# Altium project chiller_controller.PrjPcb
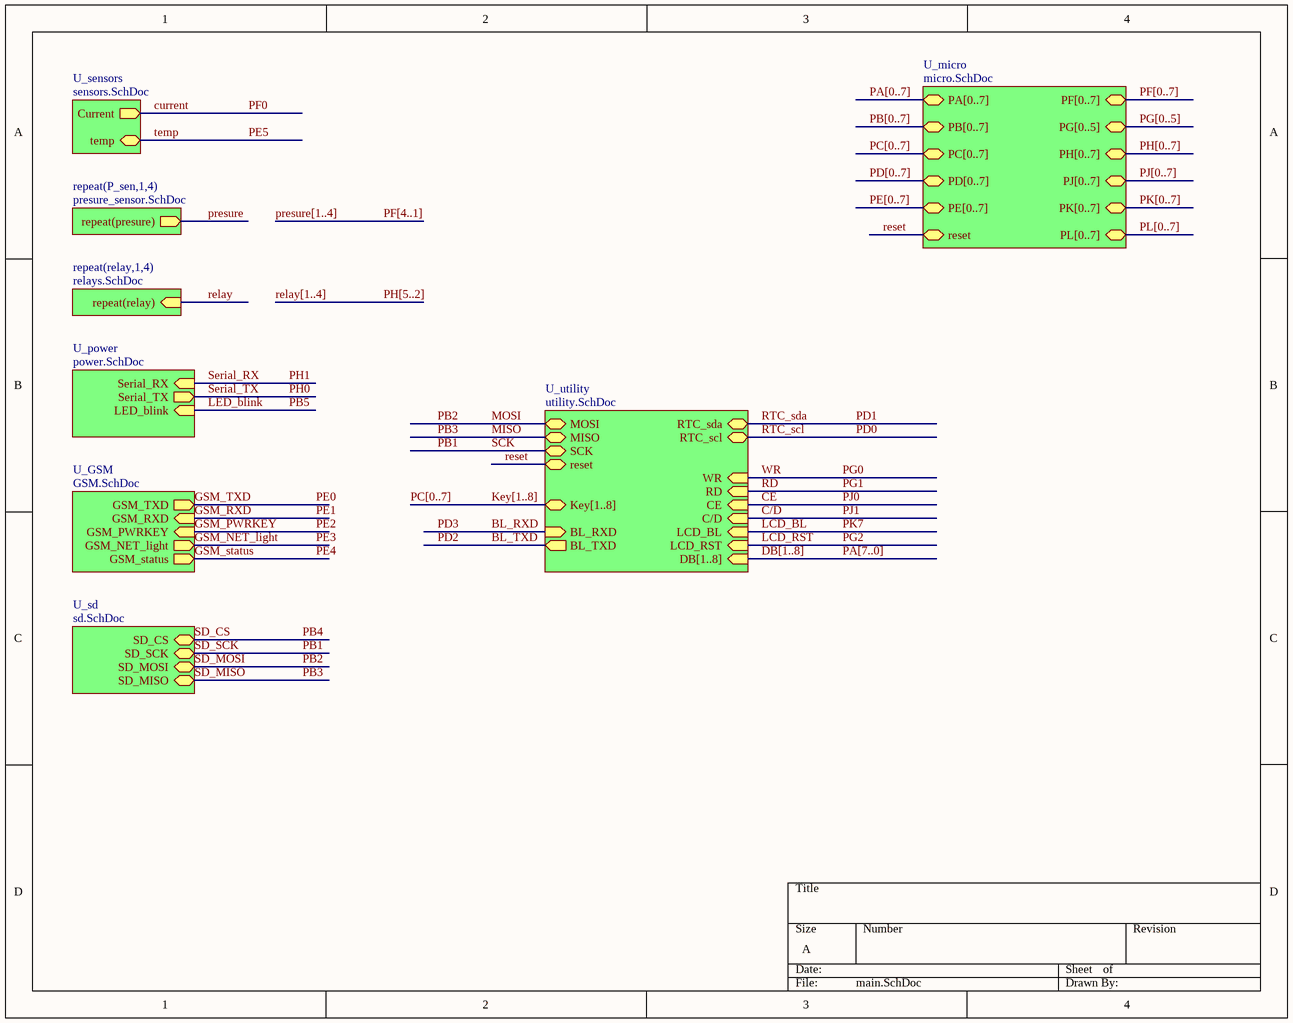
[diagram p0: main.SchDoc]
10 sheets, 200 parts. Net scope: hierarchical (ports join the sheet entries above them; power ports are global).
Board file: controller.PcbDoc
Sheets:
  main.SchDoc
    U_micro = micro.SchDoc
    U_utility = utility.SchDoc
    U_sensors = sensors.SchDoc
      sen1 = temparature sensor.SchDoc
      sen2 = temparature sensor.SchDoc
      sen3 = temparature sensor.SchDoc
      sen4 = temparature sensor.SchDoc
      sen5 = temparature sensor.SchDoc
      sen6 = temparature sensor.SchDoc
      sen7 = temparature sensor.SchDoc
      sen8 = temparature sensor.SchDoc
    P_sen1 = presure_sensor.SchDoc
    P_sen2 = presure_sensor.SchDoc
    P_sen3 = presure_sensor.SchDoc
    P_sen4 = presure_sensor.SchDoc
    relay1 = relays.SchDoc
    relay2 = relays.SchDoc
    relay3 = relays.SchDoc
    relay4 = relays.SchDoc
    U_power = power.SchDoc
    U_GSM = GSM.SchDoc
    U_sd = sd.SchDoc

## Sheet main.SchDoc
size A

### Sub-sheets
repeat(P_sen,1,4) = presure_sensor.SchDoc: repeat(presure) (out)
repeat(relay,1,4) = relays.SchDoc: repeat(relay) (in)
U_GSM = GSM.SchDoc: GSM_PWRKEY (in), GSM_RXD (in), GSM_TXD (out), GSM_NET_light (out), GSM_status (out)
U_micro = micro.SchDoc: PE[0..7] (bidir), PH[0..7] (bidir), PB[0..7] (bidir), PL[0..7] (bidir), PD[0..7] (bidir), PG[0..5] (bidir), PC[0..7] (bidir), PJ[0..7] (bidir), PA[0..7] (bidir), PK[0..7] (bidir), PF[0..7] (bidir), reset (bidir)
U_power = power.SchDoc: Serial_RX (in), Serial_TX (out), LED_blink (in)
U_sd = sd.SchDoc: SD_CS (bidir), SD_SCK (bidir), SD_MOSI (bidir), SD_MISO (bidir)
U_sensors = sensors.SchDoc: temp (bidir), Current (out)
U_utility = utility.SchDoc: MOSI (bidir), MISO (bidir), SCK (bidir), reset (bidir), RTC_sda (bidir), RTC_scl (bidir), WR (in), RD (in), CE (in), C/D (in), LCD_RST (in), DB[1..8] (in), Key[1..8] (bidir), BL_RXD (in), BL_TXD (out), LCD_BL (in)

### Nets
MISO: sheet U_utility/MISO, sheet U_sd/SD_MISO  [also labelled PB3, SD_MISO]
MOSI: sheet U_utility/MOSI, sheet U_sd/SD_MOSI  [also labelled PB2, SD_MOSI]
PB1: sheet U_utility/SCK, sheet U_sd/SD_SCK  [also labelled SCK, SD_SCK]
presure: sheet repeat(P_sen,1,4)/repeat(presure)
relay: sheet repeat(relay,1,4)/repeat(relay)
reset: sheet U_micro/reset, sheet U_utility/reset

### Buses and harness runs
bus DB[1..8] = PA[7..0] = sheet U_utility/DB[1..8]
bus Key[1..8] = PC[0..7] = sheet U_utility/Key[1..8]
bus PA[0..7] = sheet U_micro/PA[0..7]
bus PB[0..7] = sheet U_micro/PB[0..7]
bus PC[0..7] = sheet U_micro/PC[0..7]
bus PD[0..7] = sheet U_micro/PD[0..7]
bus PE[0..7] = sheet U_micro/PE[0..7]
bus PF[0..7] = sheet U_micro/PF[0..7]
bus PF[4..1] = presure[1..4]
bus PG[0..5] = sheet U_micro/PG[0..5]
bus PH[0..7] = sheet U_micro/PH[0..7]
bus PH[5..2] = relay[1..4]
bus PJ[0..7] = sheet U_micro/PJ[0..7]
bus PK[0..7] = sheet U_micro/PK[0..7]
bus PL[0..7] = sheet U_micro/PL[0..7]

## Sheet micro.SchDoc
size A
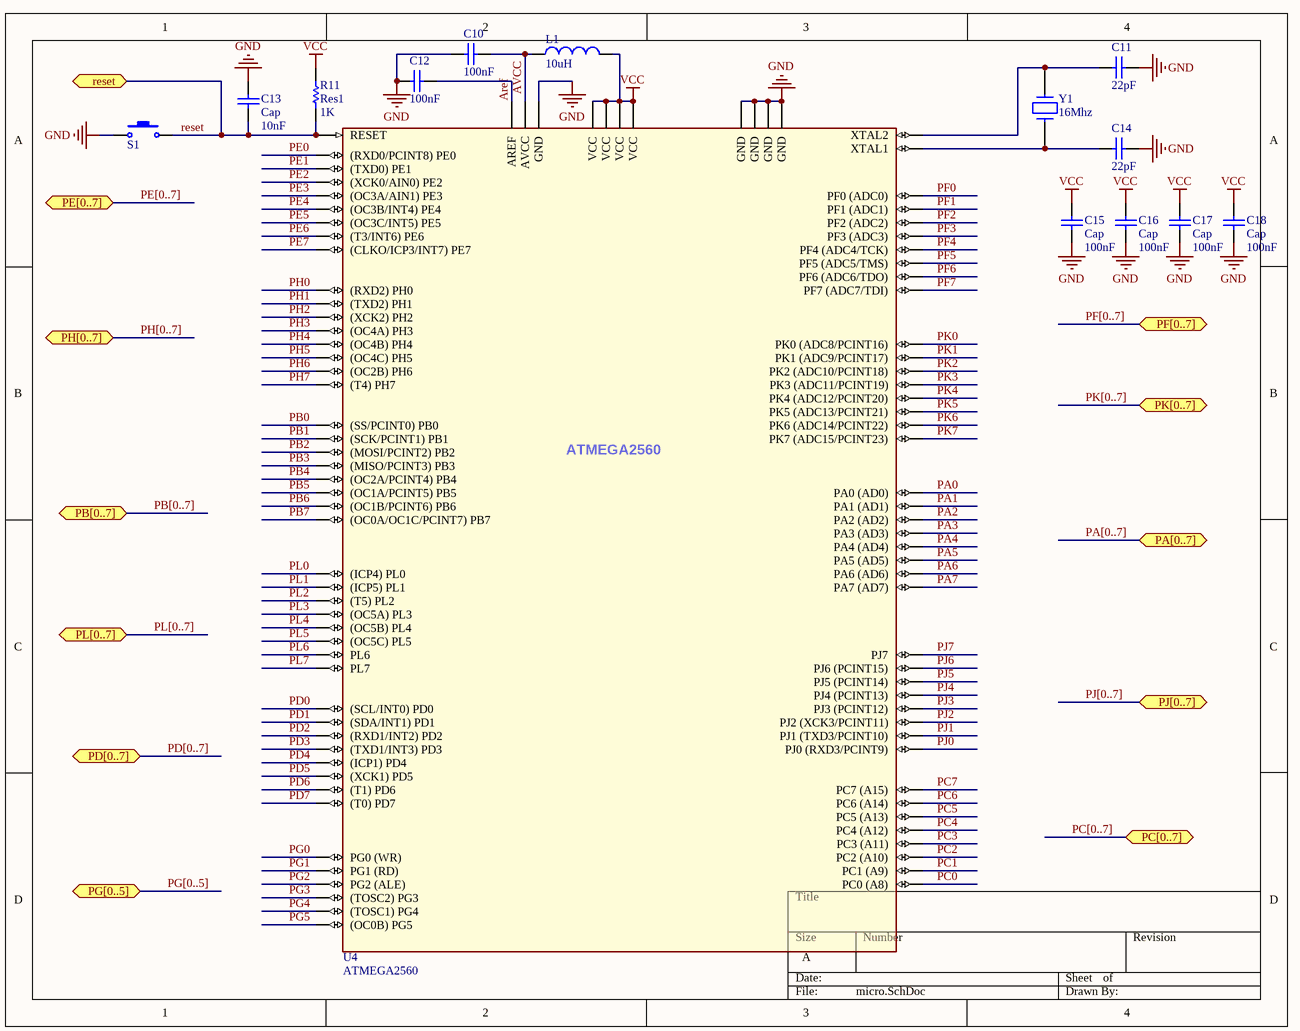
[diagram p1: micro.SchDoc]

### Parts
C10  value 100nF  [CAP 1206 (3216X15L)]  (hidden comment: Cap)
C11  value 22pF  [CAP 1206 (3216X15L)]  (hidden comment: Cap)
C12  value 100nF  [CAP 1206 (3216X15L)]  (hidden comment: Cap)
C13  Cap  value 10nF  [CAP 1206 (3216X15L)]
C14  value 22pF  [CAP 1206 (3216X15L)]  (hidden comment: Cap)
C15  Cap  value 100nF  [CAP 1206 (3216X15L)]
C16  Cap  value 100nF  [CAP 1206 (3216X15L)]
C17  Cap  value 100nF  [CAP 1206 (3216X15L)]
C18  Cap  value 100nF  [CAP 1206 (3216X15L)]
L1  value 10uH  [IND1206]  (hidden comment: Inductor)
R11  Res1  value 1K  [RES 1206 (3216X08L)]
S1  Switch PB  [Switch - Push to On]  (value not drawn)
U4  ATMEGA2560  [MY_ATMEGA2560]
Y1  16Mhz  [My_Crystal]

### Ports
PA[0..7] (bidir), PB[0..7] (bidir), PC[0..7] (bidir), PD[0..7] (bidir), PE[0..7] (bidir), PF[0..7] (bidir), PG[0..5] (bidir), PH[0..7] (bidir), PJ[0..7] (bidir), PK[0..7] (bidir), PL[0..7] (bidir), reset (bidir)

### Nets
GND: C10.1 C11.2 C12.1 C13.2 C14.2 C15.1 C16.1 C17.1 C18.1 S1.1 U4.11(GND) U4.32(GND) U4.62(GND) U4.81(GND) U4.99(GND)
VCC: C15.2 C16.2 C17.2 C18.2 L1.2 R11.2 U4.10(VCC) U4.31(VCC) U4.61(VCC) U4.80(VCC)
Aref: C12.2 U4.98(AREF)
AVCC: C10.2 L1.1 U4.100(AVCC)
PA0: U4.78(PA0_(AD0))  [project net DB8]
PA1: U4.77(PA1_(AD1))  [project net DB7]
PA2: U4.76(PA2_(AD2))  [project net DB6]
PA3: U4.75(PA3_(AD3))  [project net DB5]
PA4: U4.74(PA4_(AD4))  [project net DB4]
PA5: U4.73(PA5_(AD5))  [project net DB3]
PA6: U4.72(PA6_(AD6))  [project net DB2]
PA7: U4.71(PA7_(AD7))  [project net DB1]
PB0: U4.19((SS/PCINT0)_PB0)
PB1: U4.20((SCK/PCINT1)_PB1)
PB2: U4.21((MOSI/PCINT2)_PB2)  [project net MOSI]
PB3: U4.22((MISO/PCINT3)_PB3)  [project net MISO]
PB4: U4.23((OC2A/PCINT4)_PB4)
PB5: U4.24((OC1A/PCINT5)_PB5)  [project net LED_blink]
PB6: U4.25((OC1B/PCINT6)_PB6)
PB7: U4.26((OC0A/OC1C/PCINT7)_PB7)
PC0: U4.53(PC0_(A8))  [project net Key1]
PC1: U4.54(PC1_(A9))  [project net Key2]
PC2: U4.55(PC2_(A10))  [project net Key3]
PC3: U4.56(PC3_(A11))  [project net Key4]
PC4: U4.57(PC4_(A12))  [project net Key5]
PC5: U4.58(PC5_(A13))  [project net Key6]
PC6: U4.59(PC6_(A14))  [project net Key7]
PC7: U4.60(PC7_(A15))  [project net Key8]
PD0: U4.43((SCL/INT0)_PD0)
PD1: U4.44((SDA/INT1)_PD1)
PD2: U4.45((RXD1/INT2)_PD2)  [project net BL_TXD]
PD3: U4.46((TXD1/INT3)_PD3)  [project net BL_RXD]
PD4: U4.47((ICP1)_PD4)
PD5: U4.48((XCK1)_PD5)
PD6: U4.49((T1)_PD6)
PD7: U4.50((T0)_PD7)
PE0: U4.2((RXD0/PCINT8)_PE0)  [project net GSM_TXD]
PE1: U4.3((TXD0)_PE1)  [project net GSM_RXD]
PE2: U4.4((XCK0/AIN0)_PE2)  [project net GSM_PWRKEY]
PE3: U4.5((OC3A/AIN1)_PE3)  [project net GSM_NET_light]
PE4: U4.6((OC3B/INT4)_PE4)  [project net GSM_status]
PE5: U4.7((OC3C/INT5)_PE5)
PE6: U4.8((T3/INT6)_PE6)
PE7: U4.9((CLKO/ICP3/INT7)_PE7)
PF0: U4.97(PF0_(ADC0))  [project net current]
PF1: U4.96(PF1_(ADC1))
PF2: U4.95(PF2_(ADC2))
PF3: U4.94(PF3_(ADC3))
PF4: U4.93(PF4_(ADC4/TCK))
PF5: U4.92(PF5_(ADC5/TMS))
PF6: U4.91(PF6_(ADC6/TDO))
PF7: U4.90(PF7_(ADC7/TDI))
PG0: U4.51(PG0_(WR))
PG1: U4.52(PG1_(RD))
PG2: U4.70(PG2_(ALE))  [project net LCD_RST]
PG3: U4.28((TOSC2)_PG3)
PG4: U4.29((TOSC1)_PG4)
PG5: U4.1((OC0B)_PG5)
PH0: U4.12((RXD2)_PH0)
PH1: U4.13((TXD2)_PH1)
PH2: U4.14((XCK2)_PH2)
PH3: U4.15((OC4A)_PH3)
PH4: U4.16((OC4B)_PH4)
PH5: U4.17((OC4C)_PH5)
PH6: U4.18((OC2B)_PH6)
PH7: U4.27((T4)_PH7)
PJ0: U4.63(PJ0_(RXD3/PCINT9))  [project net CE]
PJ1: U4.64(PJ1_(TXD3/PCINT10))  [project net C/D]
PJ2: U4.65(PJ2_(XCK3/PCINT11))
PJ3: U4.66(PJ3_(PCINT12))
PJ4: U4.67(PJ4_(PCINT13))
PJ5: U4.68(PJ5_(PCINT14))
PJ6: U4.69(PJ6_(PCINT15))
PJ7: U4.79(PJ7)
PK0: U4.89(PK0_(ADC8/PCINT16))
PK1: U4.88(PK1_(ADC9/PCINT17))
PK2: U4.87(PK2_(ADC10/PCINT18))
PK3: U4.86(PK3_(ADC11/PCINT19))
PK4: U4.85(PK4_(ADC12/PCINT20))
PK5: U4.84(PK5_(ADC13/PCINT21))
PK6: U4.83(PK6_(ADC14/PCINT22))
PK7: U4.82(PK7_(ADC15/PCINT23))  [project net LCD_BL]
PL0: U4.35((ICP4)_PL0)
PL1: U4.36((ICP5)_PL1)
PL2: U4.37((T5)_PL2)
PL3: U4.38((OC5A)_PL3)
PL4: U4.39((OC5B)_PL4)
PL5: U4.40((OC5C)_PL5)
PL6: U4.41(PL6)
PL7: U4.42(PL7)
reset: C13.1 R11.1 S1.2 U4.30(RESET) ; port reset
NetC11_1: C11.1 U4.33(XTAL2) Y1.2
NetC14_1: C14.1 U4.34(XTAL1) Y1.1

### Buses and harness runs
bus PA[0..7] = port PA[0..7]
bus PB[0..7] = port PB[0..7]
bus PC[0..7] = port PC[0..7]
bus PD[0..7] = port PD[0..7]
bus PE[0..7] = port PE[0..7]
bus PF[0..7] = port PF[0..7]
bus PG[0..5] = port PG[0..5]
bus PH[0..7] = port PH[0..7]
bus PJ[0..7] = port PJ[0..7]
bus PK[0..7] = port PK[0..7]
bus PL[0..7] = port PL[0..7]

### Library data of the parts
C10-C18 = Cap ceramic: CAP-100Nf
L1 = Inductor: Code_IEC: 1005; Published: 8-Jun-2000; LatestRevisionDate: 29-May-2009; LatestRevisionNote: IPC-7351 Footprint Added.; PackageReference: 0402-A; Publisher: Altium Limited; PackageDescription: Chip Inductor; Code_JEITA: 0402
R11 = Res1: Resistor; Published: 8-Jun-2000; LatestRevisionDate: 17-Jul-2002; LatestRevisionNote: Re-released for DXP Platform.; PackageReference: AXIAL-0.3; Publisher: Altium Limited; PackageDescription: Axial Device, Thru-Hole; 2 Leads; 0.3 in Pin Spacing
S1 = Switch PB: Push Button Switch
U4 = ATMEGA2560: AVR 256K Bytes of In-System Programmable Flash Memory
Y1 = CRYSTAL

## Sheet utility.SchDoc
size A
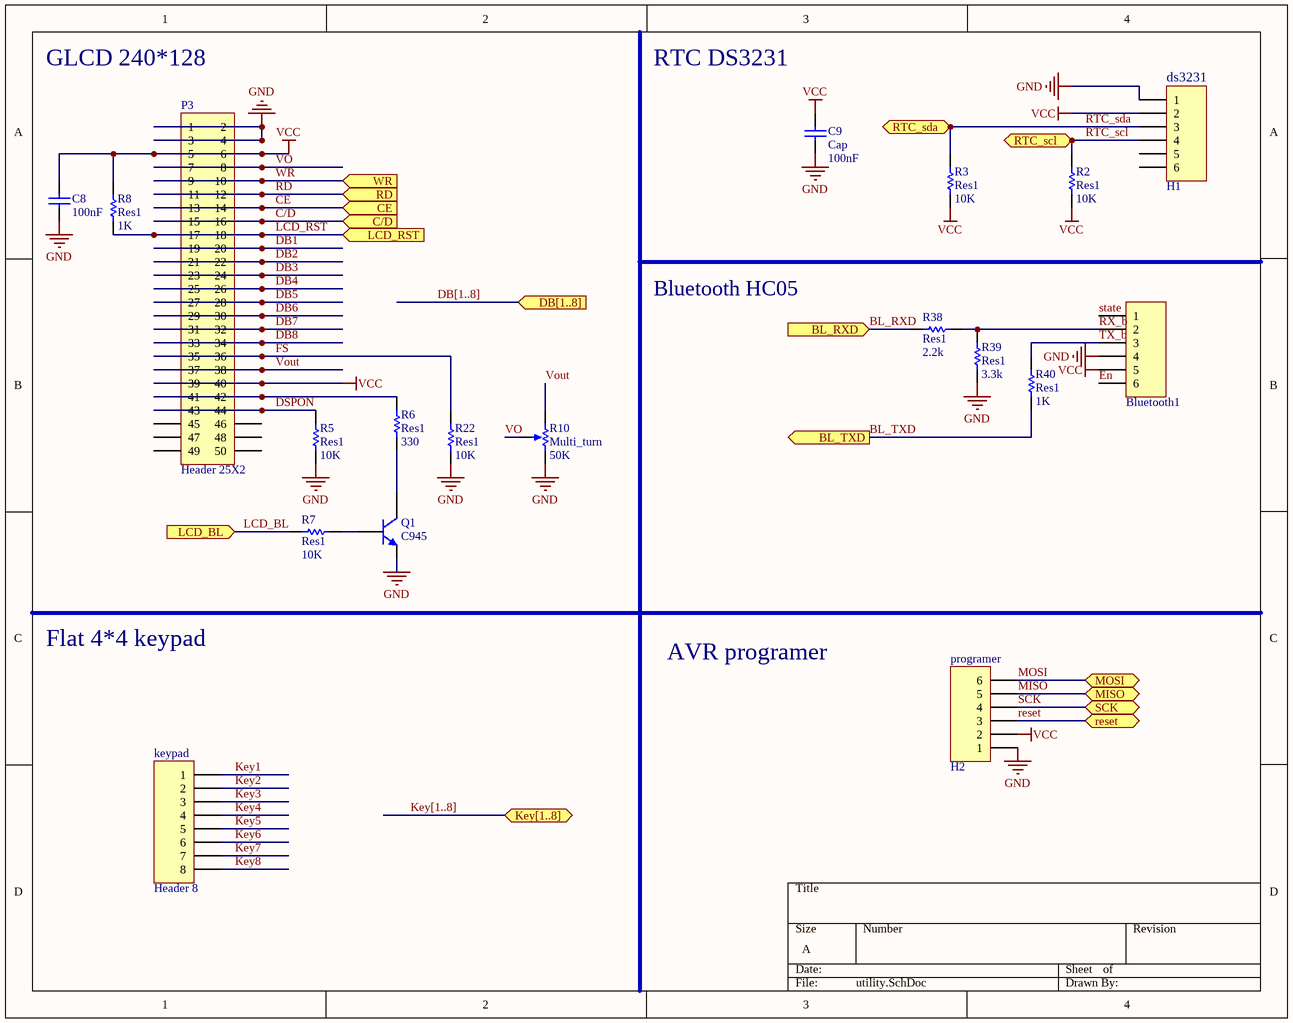
[diagram p2: utility.SchDoc]

### Parts
Bluetooth1  H-1x6  [H-1x6]  (value not drawn)
C8  value 100nF  [CAP 1206 (3216X15L)]  (hidden comment: Cap)
C9  Cap  value 100nF  [CAP 1206 (3216X15L)]
H1  H-1x6  [ds3231]  (value not drawn)
H2  programer  [HDR1X6]
keypad  Header 8  [HDR1X8]
P3  Header 25X2  [HDR2X25]
Q1  C945  [SOT23_N]
R2  Res1  value 10K  [RES 1206 (3216X08L)]
R3  Res1  value 10K  [RES 1206 (3216X08L)]
R5  Res1  value 10K  [RES 1206 (3216X08L)]
R6  Res1  value 330  [RES 1206 (3216X08L)]
R7  Res1  value 10K  [RES 1206 (3216X08L)]
R8  Res1  value 1K  [RES 1206 (3216X08L)]
R10  Multi_turn  value 50K  [Multi Turn 02]
R22  Res1  value 10K  [RES 1206 (3216X08L)]
R38  Res1  value 2.2k  [RES 1206 (3216X08L)]
R39  Res1  value 3.3k  [RES 1206 (3216X08L)]
R40  Res1  value 1K  [RES 1206 (3216X08L)]

### Ports
BL_RXD (in), BL_TXD (out), C/D (in), CE (in), DB[1..8] (in), Key[1..8] (bidir), LCD_BL (in), LCD_RST (in), MISO (bidir), MOSI (bidir), RD (in), reset (bidir), RTC_scl (bidir), RTC_sda (bidir), SCK (bidir), WR (in)

### Nets
GND: Bluetooth1.4 C8.1 C9.1 H1.1 H2.1 P3.1 P3.2 P3.3 P3.4 Q1.2(E) R5.1 R10.2(BOT) R22.1 R39.1
VCC: Bluetooth1.5 C8.2 C9.2 H1.2 H2.2 P3.5 P3.6 P3.39 P3.40 R2.1 R3.1 R8.1
BL_RXD: R38.1 ; port BL_RXD
BL_TXD: R40.2 ; port BL_TXD
C/D: P3.15 P3.16 ; port C/D
CE: P3.13 P3.14 ; port CE
DB1: P3.19 P3.20
DB2: P3.21 P3.22
DB3: P3.23 P3.24
DB4: P3.25 P3.26
DB5: P3.27 P3.28
DB6: P3.29 P3.30
DB7: P3.31 P3.32
DB8: P3.33 P3.34
DSPON: P3.43 P3.44 R5.2
En: Bluetooth1.6
FS: P3.35 P3.36 R22.2
Key1: keypad.1
Key2: keypad.2
Key3: keypad.3
Key4: keypad.4
Key5: keypad.5
Key6: keypad.6
Key7: keypad.7
Key8: keypad.8
LCD_BL: R7.2 ; port LCD_BL
LCD_RST: P3.17 P3.18 R8.2 ; port LCD_RST
MISO: H2.5 ; port MISO
MOSI: H2.6 ; port MOSI
RD: P3.11 P3.12 ; port RD  [project net PG1]
reset: H2.3 ; port reset
RTC_scl: H1.4 R2.2 ; port RTC_scl  [project net PD0]
RTC_sda: H1.3 R3.2 ; port RTC_sda  [project net PD1]
RX_b: Bluetooth1.2 R38.2 R39.2
SCK: H2.4 ; port SCK  [project net PB1]
state: Bluetooth1.1
TX_b: Bluetooth1.3 R40.1
VO: P3.7 P3.8 R10.3(TAP)
Vout: P3.37 P3.38 R10.1(TOP)
WR: P3.9 P3.10 ; port WR  [project net PG0]
NetP3_41: P3.41 P3.42 R6.2
NetQ1_1: Q1.1(B) R7.1
NetQ1_3: Q1.3(C) R6.1

Not connected (* = marked no-connect by the designer): H1 5 6; P3 45 46 47 48 49 50

### Buses and harness runs
bus DB[1..8] = port DB[1..8]
bus Key[1..8] = port Key[1..8]

### Notes on the sheet
- GLCD 240*128
- RTC DS3231
- (near H1) ds3231
- Bluetooth HC05
- Flat 4*4 keypad
- AVR programer

### Library data of the parts
C8 C9 = Cap ceramic: CAP-100Nf
H2 = H-1x6
keypad = Header 8: Header, 8-Pin; LatestRevisionDate: 17-Jul-2002; LatestRevisionNote: Re-released for DXP Platform.; Publisher: Altium Limited
P3 = Header 25X2: Header, 25-Pin, Dual row; LatestRevisionDate: 17-Jul-2002; LatestRevisionNote: Re-released for DXP Platform.; Publisher: Altium Limited
Q1 = C945: NPN Silicon Epitaxial Planar Transistor; Published: 2017-2-8; LatestRevisionDate: 2017; LatestRevisionNote: IPC-7351 Footprint Added.; DatasheetVersion: 2017; PackageVersion: 2017-2-8; PackageReference: SOT23; Publisher: Abbas Basereh; PackageDescription: 3-Pin SOT-23 Package 0.95 mm Pitch, 2.3 mm Lead Span; ComponentLink1Description: Manufacturer Link; ComponentLink1URL: http://www.taitroncomponents.com/; ComponentLink2Description: Datasheet; ComponentLink2URL: http://www.taitroncomponents.com/
R2 R3 R5-R8 R22 R38-R40 = Res1: Resistor; Published: 8-Jun-2000; LatestRevisionDate: 17-Jul-2002; LatestRevisionNote: Re-released for DXP Platform.; Publisher: Altium Limited; PackageDescription: Axial Device, Thru-Hole; 2 Leads; 0.3 in Pin Spacing
  R2 R3: PackageReference: RES 1206 (3216X08L)
  R5-R8 R22 R38-R40: PackageReference: AXIAL-0.3
R10 = Multi_turn: Potentiometer; Sim Note: Enter the Resistance value and the set point into parameter fields.; Set Position: 0.5; Published: 8-Jun-2000; LatestRevisionDate: 17-Jul-2002; LatestRevisionNote: Re-released for DXP Platform.; PackageReference: VR5; Publisher: Altium Limited

## Sheet sensors.SchDoc
size A
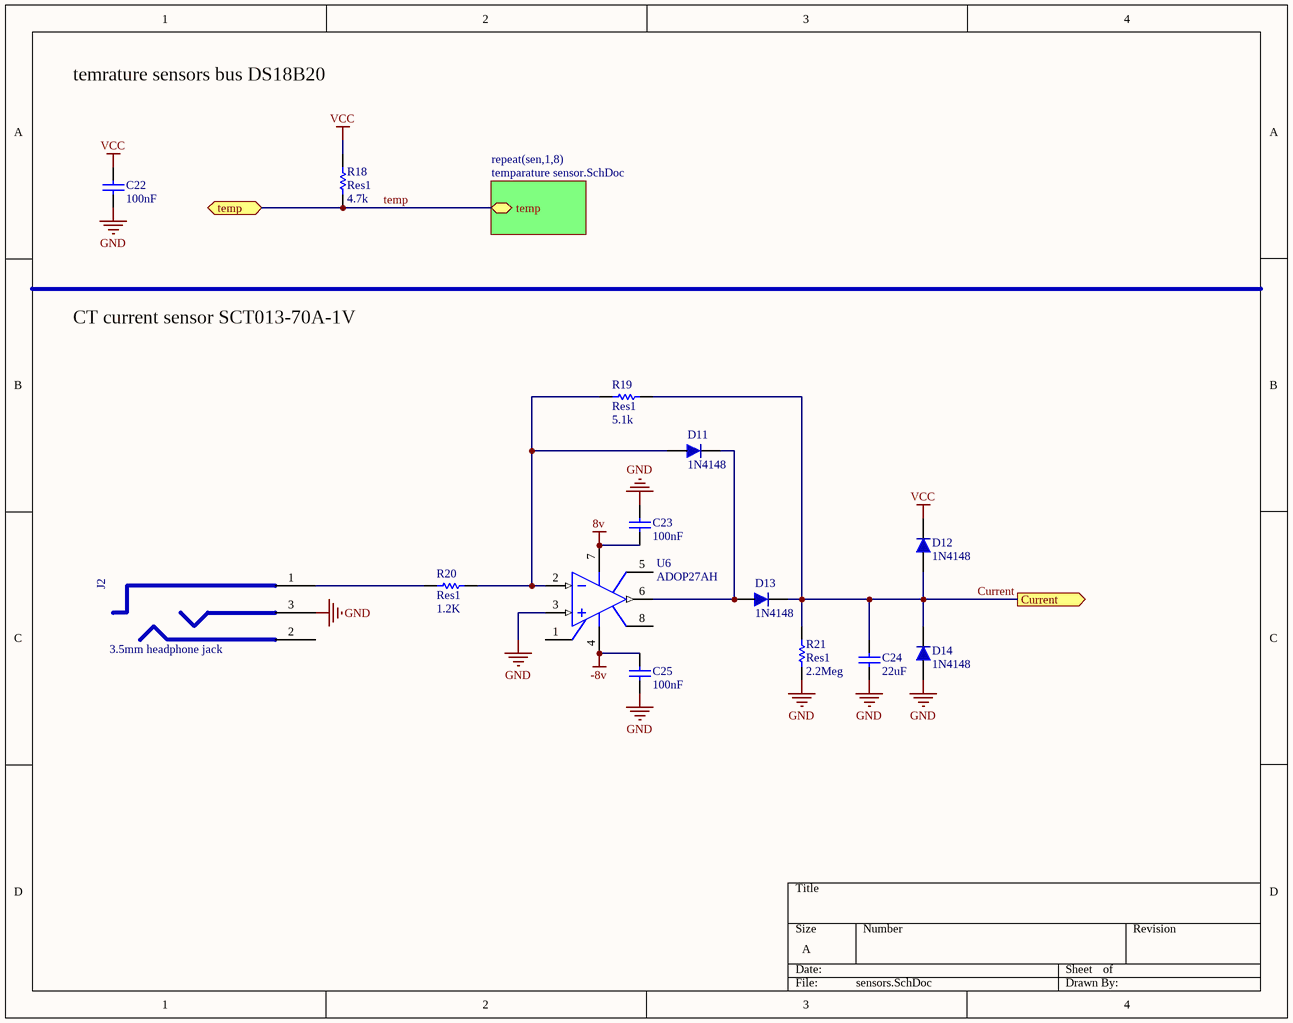
[diagram p3: sensors.SchDoc]

### Parts
C22  value 100nF  [CAP 1206 (3216X15L)]  (hidden comment: Cap)
C23  value 100nF  [CAP 1206 (3216X15L)]  (hidden comment: Cap)
C24  value 22uF  [CAP 1206 (3216X15L)]  (hidden comment: Cap)
C25  value 100nF  [CAP 1206 (3216X15L)]  (hidden comment: Cap)
D11  1N4148  [LL4148]
D12  1N4148  [LL4148]
D13  1N4148  [LL4148]
D14  1N4148  [LL4148]
J2  3.5mm headphone jack  [phone jack]
R18  Res1  value 4.7k  [RES 1206 (3216X08L)]
R19  Res1  value 5.1k  [RES 1206 (3216X08L)]
R20  Res1  value 1.2K  [RES 1206 (3216X08L)]
R21  Res1  value 2.2Meg  [RES 1206 (3216X08L)]
U6  ADOP27AH  [SOIC8-Narrow]

### Sub-sheets
repeat(sen,1,8) = temparature sensor.SchDoc: temp (bidir)

### Ports
Current (out), temp (bidir)

### Nets
8v: C23.1 U6.7(V+)
-8v: C25.2 U6.4(V-)
GND: C22.1 C23.2 C24.1 C25.1 D14.1 J2.3(Tip) R21.1 U6.3(IN+)
VCC: C22.2 D12.2 R18.2
current: C24.2 D12.1 D13.2 D14.2 R19.2 R21.2 ; port Current
temp: R18.1 ; port temp, sheet repeat(sen,1,8)/temp  [project net PE5]
NetD11_1: D11.1 R19.1 R20.2 U6.2(IN-)
NetD11_2: D11.2 D13.1 U6.6(OUT)
NetJ2_1: J2.1(Ring) R20.1

Not connected (* = marked no-connect by the designer): J2 2(Ring); U6 1(OS_NULL) 5(NC) 8(OS_NULL)

### Notes on the sheet
- temrature sensors bus DS18B20
- CT current sensor SCT013-70A-1V

### Library data of the parts
C22-C25 = Cap ceramic: CAP-100Nf
D11-D14 = 1N4148: DIODE GEN PURP 100V 200MA DO35; Published: 2017-1-12; PackageVersion: 2017-1-12; PackageReference: DO 35; Publisher: Abbas Basereh; PackageDescription: DIODE GEN PURP 100V 200MA DO35; ComponentLink1Description: Manufacturer Link; ComponentLink1URL: http://www.digikey.com/product-detail/en/fairchild-on-semiconductor/1N4148/1N4148FS-ND/458603; ComponentLink2Description: Datasheet; PART.NO: 1N4148
J2 = phone jack
R18-R21 = Res1: Resistor; Published: 8-Jun-2000; LatestRevisionDate: 17-Jul-2002; LatestRevisionNote: Re-released for DXP Platform.; PackageReference: AXIAL-0.3; Publisher: Altium Limited; PackageDescription: Axial Device, Thru-Hole; 2 Leads; 0.3 in Pin Spacing
U6 = ADOP27AH: Ultra-Low Noise, Precision Operational Amplifier; Note: Pin 5 is not connected; Pin 4 connected to case.; Published: 8-Jun-2000; LatestRevisionDate: 17-Jul-2002; LatestRevisionNote: Re-released for DXP Platform.; DatasheetVersion: 1992; PackageVersion: 1990; PackageReference: H-08A; Publisher: Altium Limited; PackageDescription: Can; 8 Leads; Pin Circle Dia. 5.08 mm; Lead Dia. 0.53 mm (max); ComponentLink1Description: Manufacturer Link; ComponentLink1URL: http://www.analog.com/

## Sheet temparature sensor.SchDoc
size A
Used 8 times, as channels U_sensors/sen1, U_sensors/sen2, U_sensors/sen3, U_sensors/sen4, U_sensors/sen5, U_sensors/sen6, U_sensors/sen7, U_sensors/sen8. Parts and nets are listed once, with the designators drawn on the sheet.
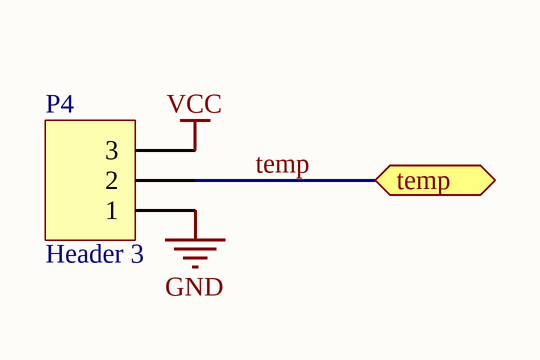
[diagram p4: temparature sensor.SchDoc]

### Parts
P4  Header 3  [3pin connector]

### Ports
temp (bidir)

### Nets
GND: P4.1
VCC: P4.3
temp: P4.2 ; port temp

### Channels
U_sensors/sen1: designators end in _sen1; ports temp=PE5
U_sensors/sen2: designators end in _sen2; ports temp=PE5
U_sensors/sen3: designators end in _sen3; ports temp=PE5
U_sensors/sen4: designators end in _sen4; ports temp=PE5
U_sensors/sen5: designators end in _sen5; ports temp=PE5
U_sensors/sen6: designators end in _sen6; ports temp=PE5
U_sensors/sen7: designators end in _sen7; ports temp=PE5
U_sensors/sen8: designators end in _sen8; ports temp=PE5

### Library data of the parts
P4 = Header 3: Header, 3-Pin; LatestRevisionDate: 17-Jul-2002; LatestRevisionNote: Re-released for DXP Platform.; Publisher: Altium Limited

## Sheet presure_sensor.SchDoc
size A
Used 4 times, as channels P_sen1, P_sen2, P_sen3, P_sen4. Parts and nets are listed once, with the designators drawn on the sheet.
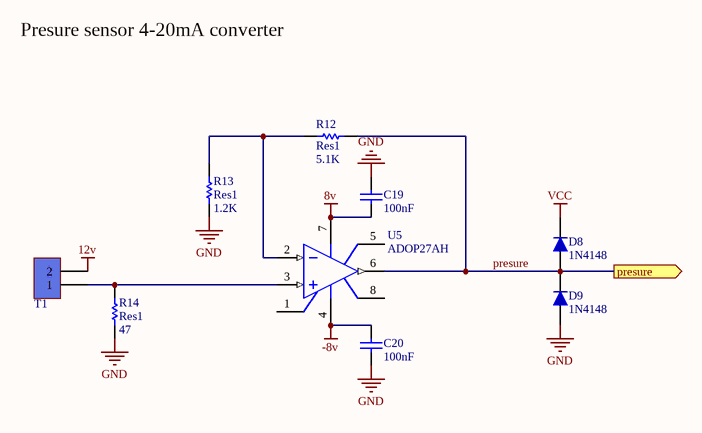
[diagram p5: presure_sensor.SchDoc]

### Parts
C19  value 100nF  [CAP 1206 (3216X15L)]  (hidden comment: Cap)
C20  value 100nF  [CAP 1206 (3216X15L)]  (hidden comment: Cap)
D8  1N4148  [LL4148]
D9  1N4148  [LL4148]
R12  Res1  value 5.1K  [RES 1206 (3216X08L)]
R13  Res1  value 1.2K  [RES 1206 (3216X08L)]
R14  Res1  value 47  [RES 1206 (3216X08L)]
T1  Terminal  [Terminal 1*2]  (value not drawn)
U5  ADOP27AH  [SOIC8-Narrow]

### Ports
presure (out)

### Nets
8v: C19.1 U5.7(V+)
12v: T1.2
-8v: C20.2 U5.4(V-)
GND: C19.2 C20.1 D9.1 R13.1 R14.1
VCC: D8.2
presure: D8.1 D9.2 R12.2 U5.6(OUT) ; port presure
NetR12_1: R12.1 R13.2 U5.2(IN-)
NetR14_2: R14.2 T1.1 U5.3(IN+)

Not connected (* = marked no-connect by the designer): U5 1(OS_NULL) 5(NC) 8(OS_NULL)

### Channels
P_sen1: designators end in _P_sen1; ports presure=PF1
P_sen2: designators end in _P_sen2; ports presure=PF2
P_sen3: designators end in _P_sen3; ports presure=PF3
P_sen4: designators end in _P_sen4; ports presure=PF4

### Notes on the sheet
- Presure sensor 4-20mA converter

### Library data of the parts
C19 C20 = Cap ceramic: CAP-100Nf
D8 D9 = 1N4148: DIODE GEN PURP 100V 200MA DO35; Published: 2017-1-12; PackageVersion: 2017-1-12; PackageReference: DO 35; Publisher: Abbas Basereh; PackageDescription: DIODE GEN PURP 100V 200MA DO35; ComponentLink1Description: Manufacturer Link; ComponentLink1URL: http://www.digikey.com/product-detail/en/fairchild-on-semiconductor/1N4148/1N4148FS-ND/458603; ComponentLink2Description: Datasheet; PART.NO: 1N4148
R12-R14 = Res1: Resistor; Published: 8-Jun-2000; LatestRevisionDate: 17-Jul-2002; LatestRevisionNote: Re-released for DXP Platform.; PackageReference: AXIAL-0.3; Publisher: Altium Limited; PackageDescription: Axial Device, Thru-Hole; 2 Leads; 0.3 in Pin Spacing
T1 = Terminal 1*2: Terminal 2 Pin 250VAC 16A; Designer: Seyed Mohsen Ghasemain; E-mail: picpars@gmail.com; ComponentLinkURL: www.picpars.com
U5 = ADOP27AH: as U6 on sheet sensors; Published: 8-Jun-2000; LatestRevisionDate: 17-Jul-2002; LatestRevisionNote: Re-released for DXP Platform.; DatasheetVersion: 1992; PackageVersion: 1990; PackageReference: H-08A; Publisher: Altium Limited; PackageDescription: Can; 8 Leads; Pin Circle Dia. 5.08 mm; Lead Dia. 0.53 mm (max); ComponentLink1Description: Manufacturer Link; ComponentLink1URL: http://www.analog.com/

## Sheet relays.SchDoc
size A
Used 4 times, as channels relay1, relay2, relay3, relay4. Parts and nets are listed once, with the designators drawn on the sheet.
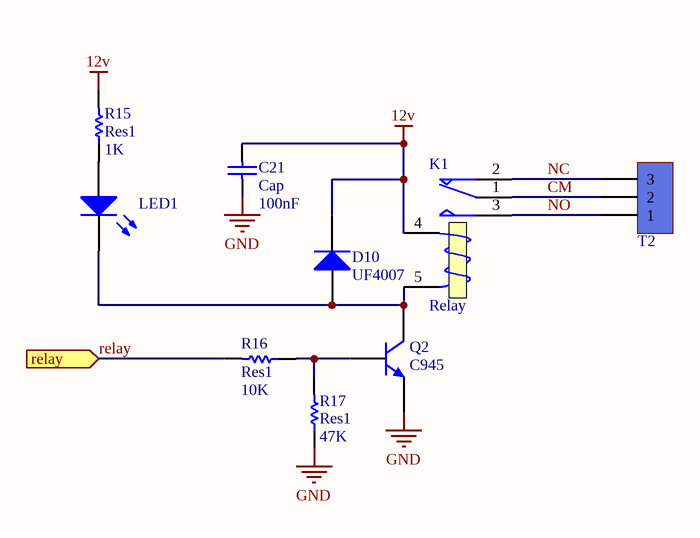
[diagram p6: relays.SchDoc]

### Parts
C21  Cap  value 100nF  [CAP 1206 (3216X15L)]
D10  UF4007  [SMA DIODE 2]
K1  Relay  [Relay 15.40x12.10x13.10]
LED1  LED0  [LED 1206]  (value not drawn)
Q2  C945  [SOT23_N]
R15  Res1  value 1K  [RES 1206 (3216X08L)]
R16  Res1  value 10K  [RES 1206 (3216X08L)]
R17  Res1  value 47K  [RES 1206 (3216X08L)]
T2  Terminal  [Terminal 1*3]  (value not drawn)

### Ports
relay (in)

### Nets
12v: C21.2 D10.2(K) K1.4(T1) R15.2
GND: C21.1 Q2.2(E) R17.1
CM: K1.1(COM) T2.2
NC: K1.2(NC) T2.3
NO: K1.3(NO) T2.1
relay: R16.2 ; port relay
NetD10_1: D10.1(A) K1.5(T2) LED1.2(K) Q2.3(C)
NetLED1_1: LED1.1(A) R15.1
NetQ2_1: Q2.1(B) R16.1 R17.2

### Channels
relay1: designators end in _relay1; ports relay=PH5
relay2: designators end in _relay2; ports relay=PH4
relay3: designators end in _relay3; ports relay=PH3
relay4: designators end in _relay4; ports relay=PH2

### Library data of the parts
C21 = Cap ceramic: CAP-100Nf
D10 = Diode: Default Diode; Published: 8-Jun-2000; LatestRevisionDate: 17-Jul-2002; LatestRevisionNote: Re-released for DXP Platform.; PackageVersion: Sep-1996; PackageReference: SMC; Publisher: Altium Limited; PackageDescription: DO-214-AB/SMC; 2 C-Bend Leads; Body 7.9 x 5.9 mm, inc. leads (LxW); Code_JEDEC: DO-214-AB
K1 = RELAY General: Relay_SPDT POWER NEEDLE; Designer: Ali Hafizi; Company: E.P.I.L; Design_Date: 2011/10/31
LED1 = LED0: Typical INFRARED GaAs LED; Published: 8-Jun-2000; LatestRevisionDate: 08-Jul-2005; LatestRevisionNote: Mech Layer 1 removed.; PackageReference: LED-0; Publisher: Altium Limited; PackageDescription: LED; 2 Leads
Q2 = C945: NPN Silicon Epitaxial Planar Transistor; Published: 2017-2-8; LatestRevisionDate: 2017; LatestRevisionNote: IPC-7351 Footprint Added.; DatasheetVersion: 2017; PackageVersion: 2017-2-8; PackageReference: SOT23; Publisher: Abbas Basereh; PackageDescription: 3-Pin SOT-23 Package 0.95 mm Pitch, 2.3 mm Lead Span; ComponentLink1Description: Manufacturer Link; ComponentLink1URL: http://www.taitroncomponents.com/; ComponentLink2Description: Datasheet; ComponentLink2URL: http://www.taitroncomponents.com/
R15-R17 = Res1: Resistor; Published: 8-Jun-2000; LatestRevisionDate: 17-Jul-2002; LatestRevisionNote: Re-released for DXP Platform.; PackageReference: AXIAL-0.3; Publisher: Altium Limited; PackageDescription: Axial Device, Thru-Hole; 2 Leads; 0.3 in Pin Spacing
T2 = Terminal 1*3: Terminal 3 Pin 250VAC 16A; Designer: Seyed Mohsen Ghasemain; E-mail: picpars@gmail.com; ComponentLinkURL: www.picpars.com

## Sheet power.SchDoc
size A
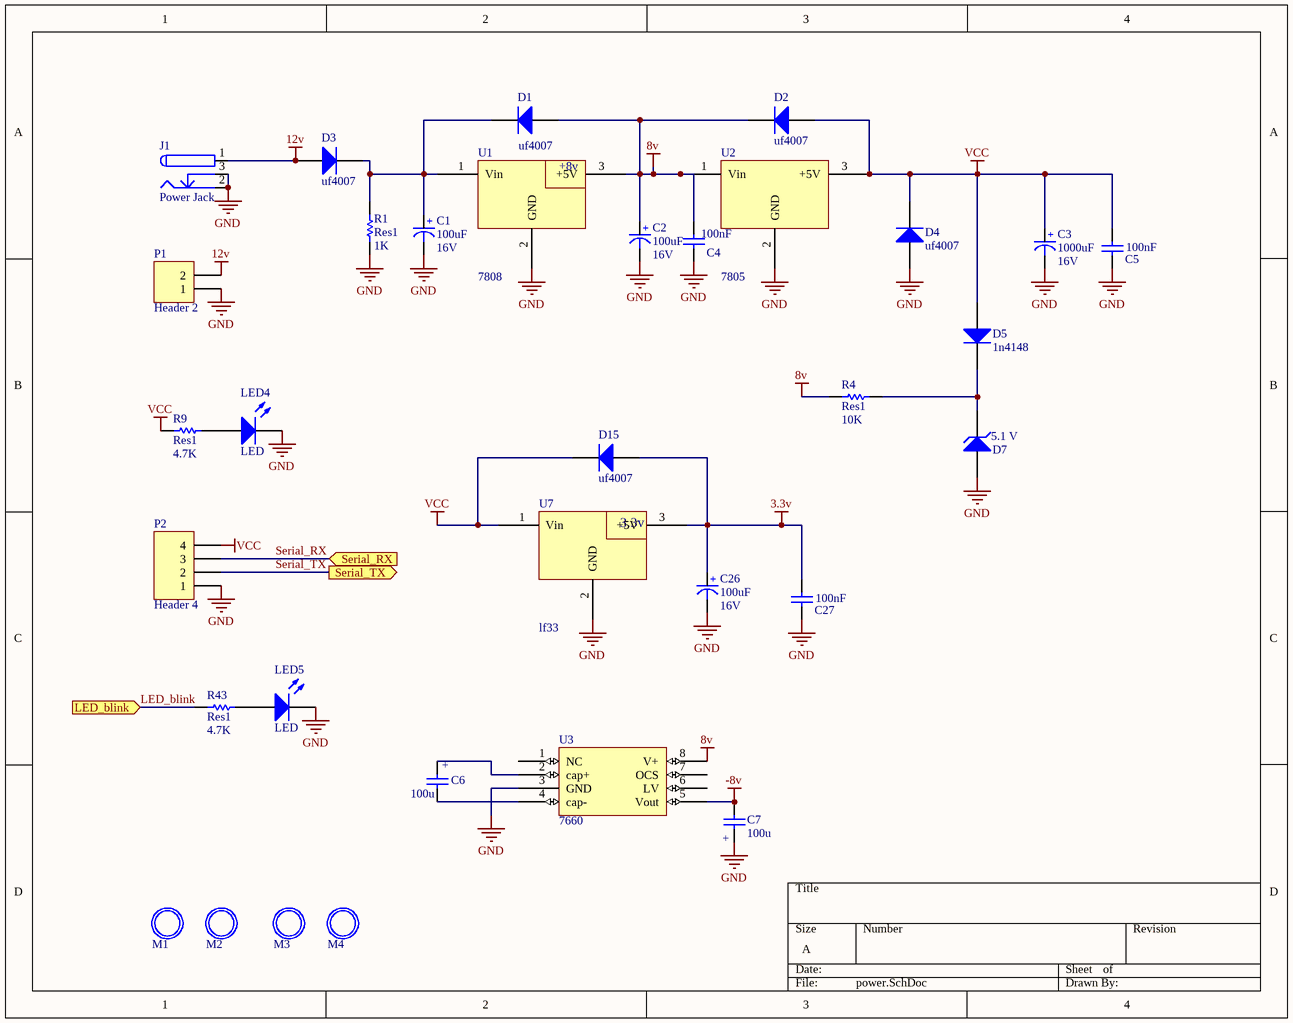
[diagram p7: power.SchDoc]

### Parts
C1  Voltage: 16V  [cap 01]  (hidden comment: 100uF)
C2  Voltage: 16V  [cap 01]  (hidden comment: 100uF)
C3  Voltage: 16V  [cap 03]  (hidden comment: 1000uF)
C4  value 100nF  [CAP 1206 (3216X15L)]  (hidden comment: Cap)
C5  value 100nF  [CAP 1206 (3216X15L)]  (hidden comment: Cap)
C6  value 100u  [cap 01]  (hidden comment: Cap)
C7  value 100u  [cap 01]  (hidden comment: Cap)
C26  Voltage: 16V  [cap 01]  (hidden comment: 100uF)
C27  value 100nF  [CAP 1206 (3216X15L)]  (hidden comment: Cap)
D1  uf4007  [SMA DIODE 2]
D2  uf4007  [SMA DIODE 2]
D3  uf4007  [SMA DIODE 2]
D4  uf4007  [SMA DIODE 2]
D5  1n4148  [LL4148]
D7  Voltage: 5.1 V  [LL4148]  (hidden comment: Diode Zener)
D15  uf4007  [SMA DIODE 2]
J1  Power Jack  [Power Jack]
LED4  LED  [LED 1206]
LED5  LED  [LED 1206]
M1  Screw  [Board Screw]  (value not drawn)
M2  Screw  [Board Screw]  (value not drawn)
M3  Screw  [Board Screw]  (value not drawn)
M4  Screw  [Board Screw]  (value not drawn)
P1  Header 2  [HDR1X2]
P2  Header 4  [HDR1X4]
R1  Res1  value 1K  [RES 1206 (3216X08L)]
R4  Res1  value 10K  [RES 1206 (3216X08L)]
R9  Res1  value 4.7K  [RES 1206 (3216X08L)]
R43  Res1  value 4.7K  [RES 1206 (3216X08L)]
U1  7808  [REG-7805-WALL]
U2  7805  [REG-7805-WALL]
U3  7660  [SOIC8-Narrow]
U7  lf33  [REG-7805-WALL]

### Ports
LED_blink (in), Serial_RX (in), Serial_TX (out)

### Nets
3.3v: C26.1(+) C27.2 D15.1(A) U7.3(+5V)
8v: C2.1(+) C4.2 D1.1(A) D2.2(K) R4.1 U1.3(+5V) U2.1(Vin) U3.8(V+)
12v: D3.1(A) J1.1 P1.2
-8v: C7.- U3.5(Vout)
GND: C1.2(-) C2.2(-) C3.2(-) C4.1 C5.1 C7.+ C26.2(-) C27.1 D4.1(A) D7.1(A) J1.2 J1.3 LED4.K LED5.K P1.1 P2.1 R1.1 U1.2(GND) U2.2(GND) U3.3(GND) U7.2(GND)
VCC: C3.1(+) C5.2 D2.1(A) D4.2(K) D5.1(A) D15.2(K) P2.4 R9.1 U2.3(+5V) U7.1(Vin)
LED_blink: R43.1 ; port LED_blink
Serial_RX: P2.3 ; port Serial_RX  [project net PH1]
Serial_TX: P2.2 ; port Serial_TX  [project net PH0]
NetC1_1: C1.1(+) D1.2(K) D3.2(K) R1.2 U1.1(Vin)
NetC6_+: C6.+ U3.2(cap+)
NetC6_-: C6.- U3.4(cap-)
NetD5_2: D5.2(K) D7.2(K) R4.2
NetLED4_A: LED4.A R9.2
NetLED5_A: LED5.A R43.2

Not connected (* = marked no-connect by the designer): U3 1(NC) 6(LV) 7(OCS)

### Notes on the sheet
- (near U1) +9v
- (near U1) +8v
- (near U7) 3.3v

### Library data of the parts
C1-C3 C26 = Cap-Polar: Polar Capacitor; Designer: Saeid Jorablo; Organazation: ControTec; Adding Date: 1387/12/20
  C1 C2 C26: Value: 100uF
  C3: Value: 1000uF
C4 C5 C27 = Cap ceramic: CAP-100Nf
C6 C7 = Cap Pol: CAP-3300Uf; pin to pad: +>1 ->2
D1-D4 D15 = Diode 1N4007: 1 Amp General Purpose Rectifier; Published: 8-Jun-2000; LatestRevisionDate: 17-Jul-2002; LatestRevisionNote: Re-released for DXP Platform.; DatasheetVersion: 1998; PackageVersion: Aug-1999; PackageReference: DO-41; Publisher: Altium Limited; PackageDescription: Diode, Axial; Body 5.2 x 2.7 mm (LxDia. max), Lead Dia. 0.86 mm (max); Code_JEDEC: DO-204-AL; ComponentLink1Description: Manufacturer Link; ComponentLink1URL: http://www.fairchildsemi.com/; ComponentLink2Description: Datasheet; ComponentLink2URL: http://www.fairchildsemi.com/ds/1N%2F1N4001.pdf
D5 = Diode 1N4148: High Conductance Fast Diode; Published: 8-Jun-2000; LatestRevisionDate: 17-Jul-2002; LatestRevisionNote: Re-released for DXP Platform.; DatasheetVersion: 1997; PackageReference: DO-35; Publisher: Altium Limited; PackageDescription: Diode, Axial; Body 3.8 x 1.9 mm (LxDia. max), Lead Dia. 0.53 mm (max); Code_JEDEC: DO-204-AH; ComponentLink1Description: Manufacturer Link; ComponentLink1URL: http://www.fairchildsemi.com/; ComponentLink2Description: Datasheet; ComponentLink2URL: http://www.fairchildsemi.com/ds/1N%2F1N4148.pdf
D7 = Diode Zener: Zener Diode; Designer: Saeid Jorablo; Company: E.P.I.L; Design Date: 2011/11/02
J1 = Power Jack: Designer: Saeid Jorablo; Company: Personal; Project Name: Laser; Adding Date: 10/21/2009
LED4 LED5 = LED: Typical INFRARED GaAs LED; pin to pad: A>1 K>2; Published: 8-Jun-2000; LatestRevisionDate: 08-Jul-2005; LatestRevisionNote: Mech Layer 1 removed.; Publisher: Altium Limited
M1-M4 = Board Screw: Board Screw With Spacer
P1 = Header 2: Header, 2-Pin; LatestRevisionDate: 17-Jul-2002; LatestRevisionNote: Re-released for DXP Platform.; Publisher: Altium Limited
P2 = Header 4: Header, 4-Pin; LatestRevisionDate: 17-Jul-2002; LatestRevisionNote: Re-released for DXP Platform.; Publisher: Altium Limited
R1 R4 R9 R43 = Res1: Resistor; Published: 8-Jun-2000; LatestRevisionDate: 17-Jul-2002; LatestRevisionNote: Re-released for DXP Platform.; PackageReference: AXIAL-0.3; Publisher: Altium Limited; PackageDescription: Axial Device, Thru-Hole; 2 Leads; 0.3 in Pin Spacing
U1 U2 U7 = 7805: Regulator

## Sheet GSM.SchDoc
size A
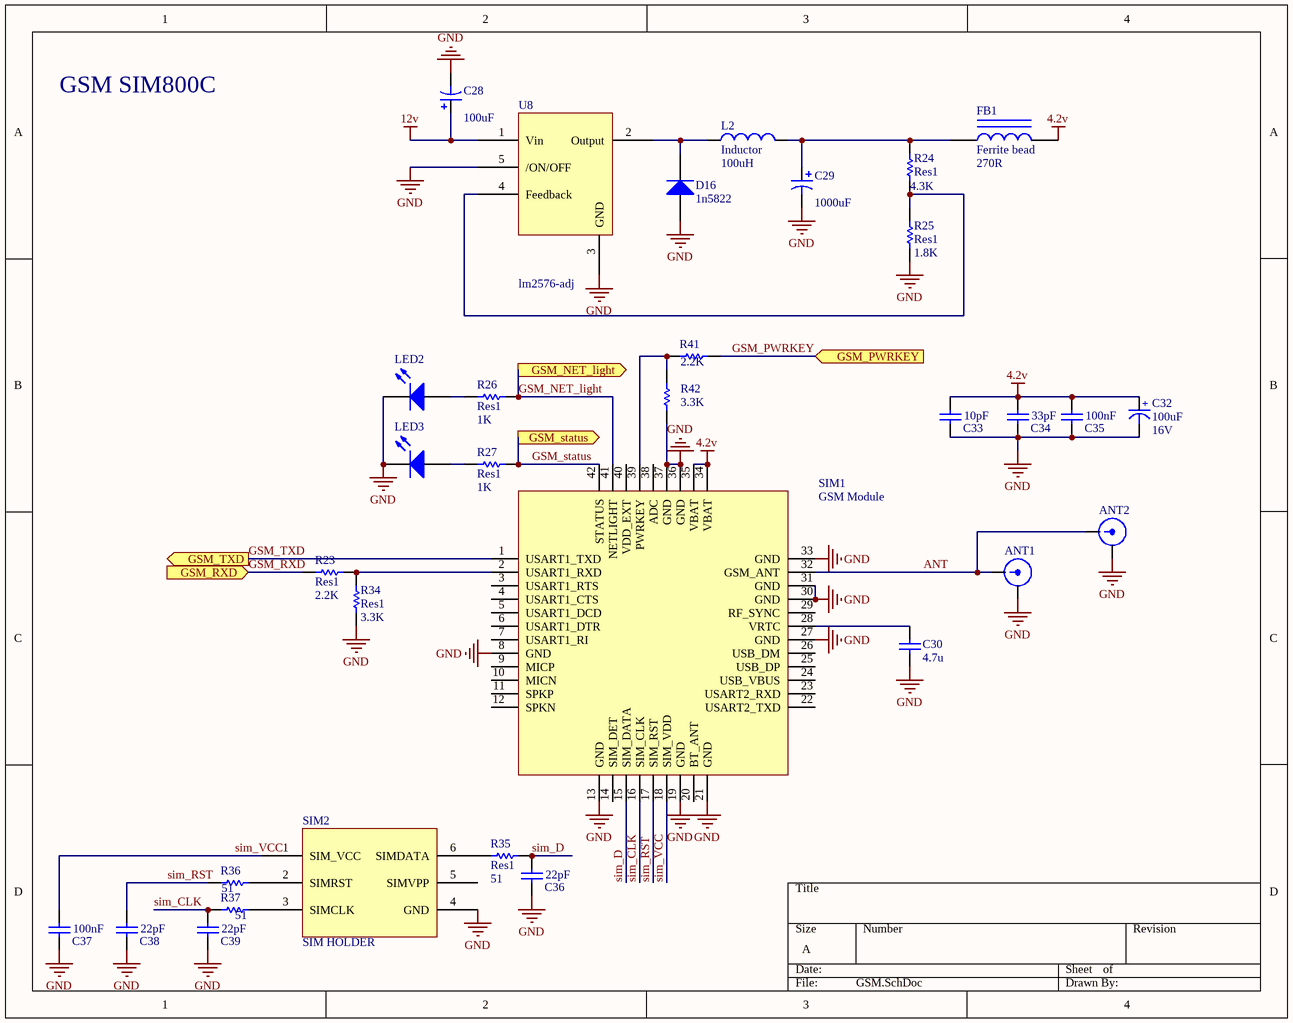
[diagram p8: GSM.SchDoc]

### Parts
ANT1  Antenna  [SMA]  (value not drawn)
ANT2  Antenna  [UFL ant]  (value not drawn)
C28  value 100uF  [Cap SMD 100UF 35~50v]
C29  value 1000uF  [CAP SMD 1000UF 16V]
C30  value 4.7u  [CAP 1206 (3216X15L)]  (hidden comment: Cap)
C32  Voltage: 16V  [cap 01]  (hidden comment: 100uF)
C33  value 10pF  [CAP 1206 (3216X15L)]  (hidden comment: Cap)
C34  value 33pF  [CAP 1206 (3216X15L)]  (hidden comment: Cap)
C35  value 100nF  [CAP 1206 (3216X15L)]  (hidden comment: Cap)
C36  value 22pF  [CAP 1206 (3216X15L)]  (hidden comment: Cap)
C37  value 100nF  [CAP 1206 (3216X15L)]  (hidden comment: Cap)
C38  value 22pF  [CAP 1206 (3216X15L)]  (hidden comment: Cap)
C39  value 22pF  [CAP 1206 (3216X15L)]  (hidden comment: Cap)
D16  1n5822  [SMA DIODE 2]
FB1  Ferrite bead  value 270R  [FB1206]
L2  Inductor  value 100uH  [inductor]
LED2  LED  [LED 1206]  (value not drawn)
LED3  LED  [LED 1206]  (value not drawn)
R23  Res1  value 2.2K  [RES 1206 (3216X08L)]
R24  Res1  value 4.3K  [RES 1206 (3216X08L)]
R25  Res1  value 1.8K  [RES 1206 (3216X08L)]
R26  Res1  value 1K  [RES 1206 (3216X08L)]
R27  Res1  value 1K  [RES 1206 (3216X08L)]
R34  Res1  value 3.3K  [RES 1206 (3216X08L)]
R35  Res1  value 51  [RES 1206 (3216X08L)]
R36  value 51  [RES 1206 (3216X08L)]  (hidden comment: Res1)
R37  value 51  [RES 1206 (3216X08L)]  (hidden comment: Res1)
R41  value 2.2K  [RES 1206 (3216X08L)]  (hidden comment: Res1)
R42  value 3.3K  [RES 1206 (3216X08L)]  (hidden comment: Res1)
SIM1  GSM Module  [SIM800C]
SIM2  SIM HOLDER  [simcard_holder]
U8  lm2576-adj  [2596]

### Ports
GSM_NET_light (out), GSM_PWRKEY (in), GSM_RXD (in), GSM_status (out), GSM_TXD (out)

### Nets
4.2v: C32.1(+) C33.2 C34.2 C35.2 FB1.2 SIM1.34(VBAT) SIM1.35(VBAT)
12v: C28.1 U8.1(Vin)
GND: ANT1.2 ANT2.2 C28.2 C29.2 C30.1 C32.2(-) C33.1 C34.1 C35.1 C36.1 C37.1 C38.1 C39.1 D16.1(A) LED2.K LED3.K R25.1 R34.2 R42.1 SIM1.8(GND) SIM1.13(GND) SIM1.19(GND) SIM1.21(GND) SIM1.27(GND) SIM1.30(GND) SIM1.31(GND) SIM1.33(GND) SIM1.36(GND) SIM1.37(GND) SIM2.4(GND) U8.3(GND) U8.5(/ON/OFF)
ANT: ANT1.1 ANT2.1 SIM1.32(GSM_ANT)
GSM_NET_light: R26.1 SIM1.41(NETLIGHT) ; port GSM_NET_light
GSM_PWRKEY: R41.1 ; port GSM_PWRKEY
GSM_RXD: R23.2 ; port GSM_RXD
GSM_status: R27.1 SIM1.42(STATUS) ; port GSM_status
GSM_TXD: SIM1.1(USART1_TXD) ; port GSM_TXD
sim_CLK: C39.2 R37.1 SIM1.16(SIM_CLK)
sim_D: C36.2 R35.2 SIM1.15(SIM_DATA)
sim_RST: C38.2 R36.1 SIM1.17(SIM_RST)
sim_VCC: C37.2 SIM1.18(SIM_VDD) SIM2.1(SIM_VCC)
NetC29_1: C29.1 FB1.1 L2.2 R24.2
NetC30_2: C30.2 SIM1.28(VRTC)
NetD16_2: D16.2(K) L2.1 U8.2(Output)
NetLED2_A: LED2.A R26.2
NetLED3_A: LED3.A R27.2
NetR23_1: R23.1 R34.1 SIM1.2(USART1_RXD)
NetR24_1: R24.1 R25.2 U8.4(Feedback)
NetR35_1: R35.1 SIM2.6(SIMDATA)
NetR36_2: R36.2 SIM2.2(SIMRST)
NetR37_2: R37.2 SIM2.3(SIMCLK)
NetR41_2: R41.2 R42.2 SIM1.39(PWRKEY)

Not connected (* = marked no-connect by the designer): SIM1 3(USART1_RTS) 4(USART1_CTS) 5(USART1_DCD) 6(USART1_DTR) 7(USART1_RI) 9(MICP) 10(MICN) 11(SPKP) 12(SPKN) 14(SIM_DET) 20(BT_ANT) 22(USART2_TXD) 23(USART2_RXD) 24(USB_VBUS) 25(USB_DP) 26(USB_DM) 29(RF_SYNC) 38(ADC) 40(VDD_EXT); SIM2 5(SIMVPP)

### Notes on the sheet
- GSM SIM800C

### Library data of the parts
ANT1 = ANT SMA: Designer: Ali Hafizi
ANT2 = ANT SMA: pin to pad: 1>S 2>G; Designer: Ali Hafizi
C28 C29 = Cap Pol1: Polarized Capacitor (Radial); Published: 8-Jun-2000; LatestRevisionDate: 17-Jul-2002; LatestRevisionNote: Re-released for DXP Platform.; PackageReference: RB7.6-15; Publisher: Altium Limited; PackageDescription: Polarized Capacitor (Radial); 2 Leads
C30 C33-C39 = Cap ceramic: CAP-100Nf
C32 = Cap-Polar: as C1 on sheet power; Adding Date: 1387/12/20; Value: 100uF
D16 = Diode 1N4007: 1 Amp General Purpose Rectifier; Published: 8-Jun-2000; LatestRevisionDate: 17-Jul-2002; LatestRevisionNote: Re-released for DXP Platform.; DatasheetVersion: 1998; PackageVersion: Aug-1999; PackageReference: DO-41; Publisher: Altium Limited; PackageDescription: Diode, Axial; Body 5.2 x 2.7 mm (LxDia. max), Lead Dia. 0.86 mm (max); Code_JEDEC: DO-204-AL; ComponentLink1Description: Manufacturer Link; ComponentLink1URL: http://www.fairchildsemi.com/; ComponentLink2Description: Datasheet; ComponentLink2URL: http://www.fairchildsemi.com/ds/1N%2F1N4001.pdf
FB1 = Inductor Iron: Magnetic-Core Inductor; Published: 24-Mar-1999; LatestRevisionDate: 17-Jul-2002; LatestRevisionNote: Re-released for DXP Platform.; PackageReference: AXIAL-0.9; Publisher: Altium Limited; PackageDescription: Axial Device, Thru-Hole; 2 Leads; 0.9 in Pin Spacing
L2 = Inductor: Code_IEC: 1005; Published: 8-Jun-2000; LatestRevisionDate: 29-May-2009; LatestRevisionNote: IPC-7351 Footprint Added.; PackageReference: 0402-A; Publisher: Altium Limited; PackageDescription: Chip Inductor; Code_JEITA: 0402
LED2 LED3 = LED: Typical INFRARED GaAs LED; pin to pad: A>1 K>2; Published: 8-Jun-2000; LatestRevisionDate: 08-Jul-2005; LatestRevisionNote: Mech Layer 1 removed.; Publisher: Altium Limited
R23-R27 R34-R37 R41 R42 = Res1: Resistor; Published: 8-Jun-2000; LatestRevisionDate: 17-Jul-2002; LatestRevisionNote: Re-released for DXP Platform.; PackageReference: AXIAL-0.3; Publisher: Altium Limited; PackageDescription: Axial Device, Thru-Hole; 2 Leads; 0.3 in Pin Spacing
SIM1 = SIM800C: Designer: Ali Hafizi
SIM2 = SIM HOLDER: Deigner: Ali Hafizi
U8 = lm2596

## Sheet sd.SchDoc
size A
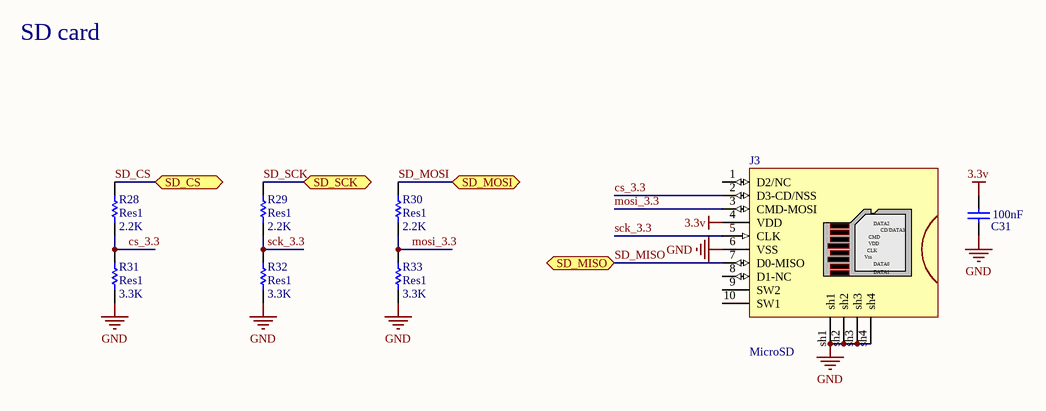
[diagram p9: sd.SchDoc]

### Parts
C31  value 100nF  [CAP 1206 (3216X15L)]  (hidden comment: Cap)
J3  MicroSD  [SD_card]
R28  Res1  value 2.2K  [RES 1206 (3216X08L)]
R29  Res1  value 2.2K  [RES 1206 (3216X08L)]
R30  Res1  value 2.2K  [RES 1206 (3216X08L)]
R31  Res1  value 3.3K  [RES 1206 (3216X08L)]
R32  Res1  value 3.3K  [RES 1206 (3216X08L)]
R33  Res1  value 3.3K  [RES 1206 (3216X08L)]

### Ports
SD_CS (bidir), SD_MISO (bidir), SD_MOSI (bidir), SD_SCK (bidir)

### Nets
3.3v: C31.2 J3.4(VDD)
GND: C31.1 J3.6(VSS) J3.sh1 J3.sh2 J3.sh3 J3.sh4 R31.1 R32.1 R33.1
cs_3.3: J3.2(D3-CD/NSS) R28.1 R31.2
mosi_3.3: J3.3(CMD-MOSI) R30.1 R33.2
sck_3.3: J3.5(CLK) R29.1 R32.2
SD_CS: R28.2 ; port SD_CS  [project net PB4]
SD_MISO: J3.7(D0-MISO) ; port SD_MISO  [project net MISO]
SD_MOSI: R30.2 ; port SD_MOSI  [project net MOSI]
SD_SCK: R29.2 ; port SD_SCK  [project net PB1]

Not connected (* = marked no-connect by the designer): J3 1(D2/NC) 8(D1-NC) 9(SW2) 10(SW1)

### Notes on the sheet
- SD card
- (in symbol MicroSD) DATA2; CD/DATA3; CMD; Vss; DATA0; DATA1

### Library data of the parts
C31 = Cap ceramic: CAP-100Nf
J3 = MicroSD: MicroSD_altium designer (M.Hariri); Created by:: altium designer (M.Hariri); VALUE: MicroSD
R28-R33 = Res1: Resistor; Published: 8-Jun-2000; LatestRevisionDate: 17-Jul-2002; LatestRevisionNote: Re-released for DXP Platform.; PackageReference: AXIAL-0.3; Publisher: Altium Limited; PackageDescription: Axial Device, Thru-Hole; 2 Leads; 0.3 in Pin Spacing

## Nets that join several sheets
3.3v: power (C26.1 C27.2 D15.1 U7.3), sd (C31.2 J3.4)
8v: sensors (C23.1 U6.7), P_sen1 (C19_P_sen1.1 U5_P_sen1.7), P_sen2 (C19_P_sen2.1 U5_P_sen2.7), P_sen3 (C19_P_sen3.1 U5_P_sen3.7), P_sen4 (C19_P_sen4.1 U5_P_sen4.7), power (8 pins)
12v: P_sen1 (T1_P_sen1.2), P_sen2 (T1_P_sen2.2), P_sen3 (T1_P_sen3.2), P_sen4 (T1_P_sen4.2), relay1 (C21_relay1.2 D10_relay1.2 K1_relay1.4 R15_relay1.2), relay2 (C21_relay2.2 D10_relay2.2 K1_relay2.4 R15_relay2.2), relay3 (C21_relay3.2 D10_relay3.2 K1_relay3.4 R15_relay3.2), relay4 (C21_relay4.2 D10_relay4.2 K1_relay4.4 R15_relay4.2), power (D3.1 J1.1 P1.2), GSM (C28.1 U8.1)
-8v: sensors (C25.2 U6.4), P_sen1 (C20_P_sen1.2 U5_P_sen1.4), P_sen2 (C20_P_sen2.2 U5_P_sen2.4), P_sen3 (C20_P_sen3.2 U5_P_sen3.4), P_sen4 (C20_P_sen4.2 U5_P_sen4.4), power (C7.- U3.5)
GND: micro (15 pins), utility (14 pins), sensors (8 pins), U_sensors/sen1 (P4_sen1.1), U_sensors/sen2 (P4_sen2.1), U_sensors/sen3 (P4_sen3.1), U_sensors/sen4 (P4_sen4.1), U_sensors/sen5 (P4_sen5.1), U_sensors/sen6 (P4_sen6.1), U_sensors/sen7 (P4_sen7.1), U_sensors/sen8 (P4_sen8.1), P_sen1 (5 pins), P_sen2 (5 pins), P_sen3 (5 pins), P_sen4 (5 pins), relay1 (C21_relay1.1 Q2_relay1.2 R17_relay1.1), relay2 (C21_relay2.1 Q2_relay2.2 R17_relay2.1), relay3 (C21_relay3.1 Q2_relay3.2 R17_relay3.1), relay4 (C21_relay4.1 Q2_relay4.2 R17_relay4.1), power (21 pins), GSM (32 pins), sd (9 pins)
VCC: micro (10 pins), utility (12 pins), sensors (C22.2 D12.2 R18.2), U_sensors/sen1 (P4_sen1.3), U_sensors/sen2 (P4_sen2.3), U_sensors/sen3 (P4_sen3.3), U_sensors/sen4 (P4_sen4.3), U_sensors/sen5 (P4_sen5.3), U_sensors/sen6 (P4_sen6.3), U_sensors/sen7 (P4_sen7.3), U_sensors/sen8 (P4_sen8.3), P_sen1 (D8_P_sen1.2), P_sen2 (D8_P_sen2.2), P_sen3 (D8_P_sen3.2), P_sen4 (D8_P_sen4.2), power (10 pins)
BL_RXD: micro (U4.46), utility (R38.1)
BL_TXD: micro (U4.45), utility (R40.2)
C/D: micro (U4.64), utility (P3.15 P3.16)
CE: micro (U4.63), utility (P3.13 P3.14)
current: micro (U4.97), sensors (6 pins)
DB1: micro (U4.71), utility (P3.19 P3.20)
DB2: micro (U4.72), utility (P3.21 P3.22)
DB3: micro (U4.73), utility (P3.23 P3.24)
DB4: micro (U4.74), utility (P3.25 P3.26)
DB5: micro (U4.75), utility (P3.27 P3.28)
DB6: micro (U4.76), utility (P3.29 P3.30)
DB7: micro (U4.77), utility (P3.31 P3.32)
DB8: micro (U4.78), utility (P3.33 P3.34)
GSM_NET_light: micro (U4.5), GSM (R26.1 SIM1.41)
GSM_PWRKEY: micro (U4.4), GSM (R41.1)
GSM_RXD: micro (U4.3), GSM (R23.2)
GSM_status: micro (U4.6), GSM (R27.1 SIM1.42)
GSM_TXD: micro (U4.2), GSM (SIM1.1)
Key1: micro (U4.53), utility (keypad.1)
Key2: micro (U4.54), utility (keypad.2)
Key3: micro (U4.55), utility (keypad.3)
Key4: micro (U4.56), utility (keypad.4)
Key5: micro (U4.57), utility (keypad.5)
Key6: micro (U4.58), utility (keypad.6)
Key7: micro (U4.59), utility (keypad.7)
Key8: micro (U4.60), utility (keypad.8)
LCD_BL: micro (U4.82), utility (R7.2)
LCD_RST: micro (U4.70), utility (P3.17 P3.18 R8.2)
LED_blink: micro (U4.24), power (R43.1)
MISO: micro (U4.22), utility (H2.5), sd (J3.7)
MOSI: micro (U4.21), utility (H2.6), sd (R30.2)
PB1: micro (U4.20), utility (H2.4), sd (R29.2)
PB4: micro (U4.23), sd (R28.2)
PD0: micro (U4.43), utility (H1.4 R2.2)
PD1: micro (U4.44), utility (H1.3 R3.2)
PE5: micro (U4.7), sensors (R18.1), U_sensors/sen1 (P4_sen1.2), U_sensors/sen2 (P4_sen2.2), U_sensors/sen3 (P4_sen3.2), U_sensors/sen4 (P4_sen4.2), U_sensors/sen5 (P4_sen5.2), U_sensors/sen6 (P4_sen6.2), U_sensors/sen7 (P4_sen7.2), U_sensors/sen8 (P4_sen8.2)
PF1: micro (U4.96), P_sen1 (D8_P_sen1.1 D9_P_sen1.2 R12_P_sen1.2 U5_P_sen1.6)
PF2: micro (U4.95), P_sen2 (D8_P_sen2.1 D9_P_sen2.2 R12_P_sen2.2 U5_P_sen2.6)
PF3: micro (U4.94), P_sen3 (D8_P_sen3.1 D9_P_sen3.2 R12_P_sen3.2 U5_P_sen3.6)
PF4: micro (U4.93), P_sen4 (D8_P_sen4.1 D9_P_sen4.2 R12_P_sen4.2 U5_P_sen4.6)
PG0: micro (U4.51), utility (P3.9 P3.10)
PG1: micro (U4.52), utility (P3.11 P3.12)
PH0: micro (U4.12), power (P2.2)
PH1: micro (U4.13), power (P2.3)
PH2: micro (U4.14), relay4 (R16_relay4.2)
PH3: micro (U4.15), relay3 (R16_relay3.2)
PH4: micro (U4.16), relay2 (R16_relay2.2)
PH5: micro (U4.17), relay1 (R16_relay1.2)
reset: micro (C13.1 R11.1 S1.2 U4.30), utility (H2.3)